# Altium project Hammerhead.PrjPCB (part 2 of 2)
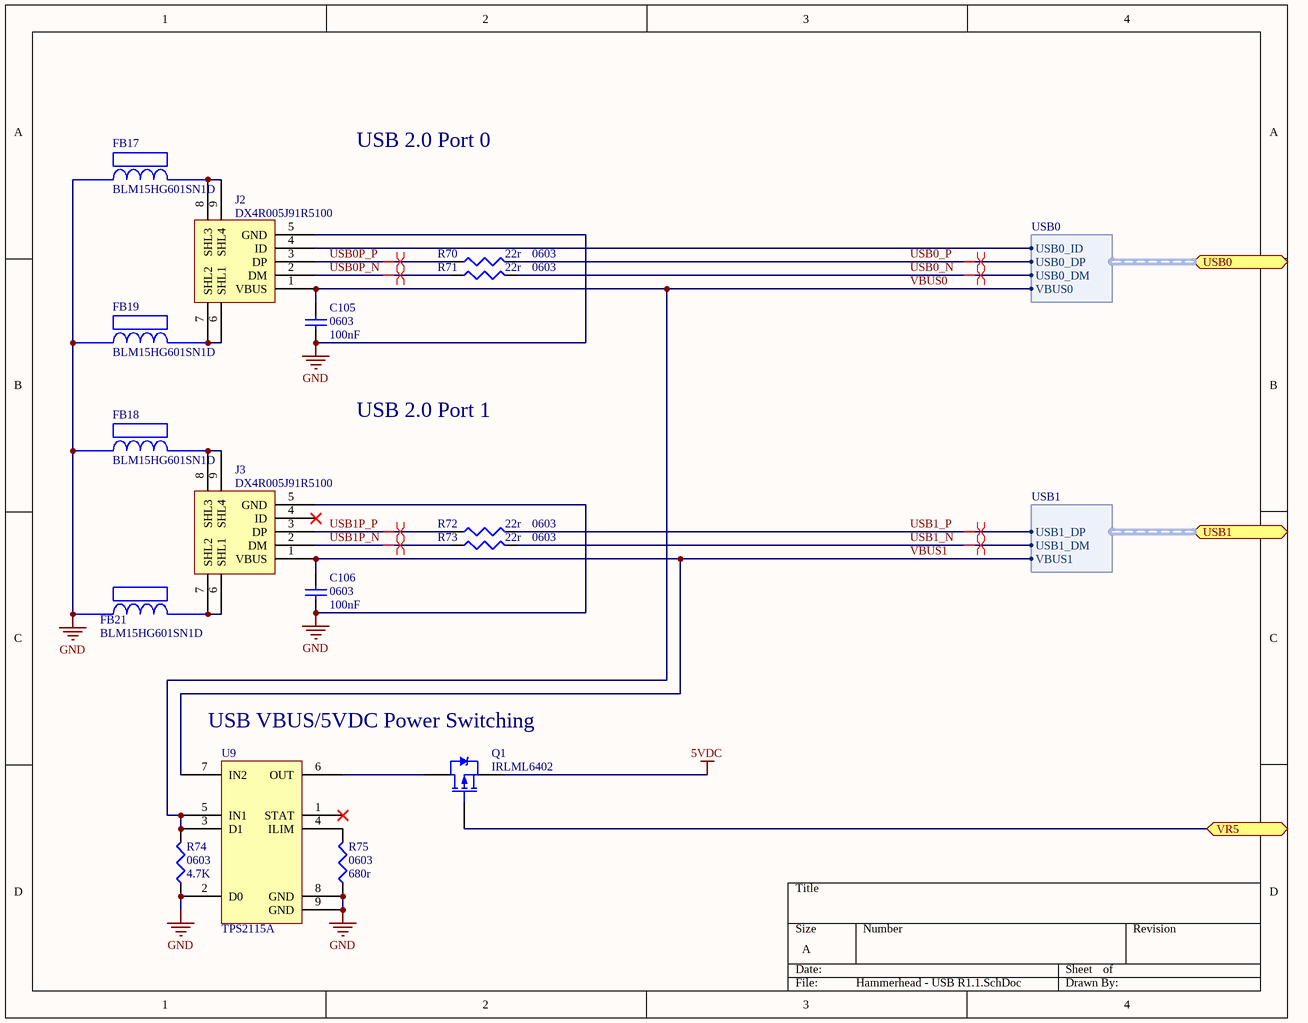
[diagram p8: Hammerhead - USB R1.1.SchDoc]

## Nets that join several sheets
5VDC: Hammerhead - Arduino Leonardo Shield Headers R1.1 (P1.9), Hammerhead - LPC4337 MCU R1.1 (C7.2 C8.2 P7.4 U2.14), Hammerhead - MAX11300 Breakout Connectors R1.1 (P9.1 P10.1), Hammerhead - Power R1.1 (6 pins), Hammerhead - USB R1.1 (Q1.3)
-AVDD: Hammerhead - MAX11300 Analog Hub R1.1 (5 pins), Hammerhead - Power R1.1 (C54.2 C56.2 FB16.2)
AVDD: Hammerhead - MAX11300 Analog Hub R1.1 (6 pins), Hammerhead - Power R1.1 (7 pins)
DVDD: Hammerhead - Arduino Leonardo Shield Headers R1.1 (P1.3 P1.7 P2.2), Hammerhead - LPC4337 MCU R1.1 (42 pins), Hammerhead - MAX11300 Analog Hub R1.1 (R20.1), Hammerhead - Power R1.1 (C101.1 C102#2.2 R21.2 U8.1)
GND: Hammerhead - Arduino Leonardo Shield Headers R1.1 (P1.11 P1.13 P2.6 P3.8), Hammerhead - LPC4337 MCU R1.1 (45 pins), Hammerhead - MAX11300 Analog Hub R1.1 (24 pins), Hammerhead - MAX11300 Breakout Connectors R1.1 (6 pins), Hammerhead - Power R1.1 (42 pins), Hammerhead - USB R1.1 (13 pins)
VIN: Hammerhead - Arduino Leonardo Shield Headers R1.1 (P1.15), Hammerhead - MAX11300 Breakout Connectors R1.1 (P9.3 P10.3), Hammerhead - Power R1.1 (10 pins)
ADC0_5: Hammerhead - Arduino Leonardo Shield Headers R1.1 (P5.2), Hammerhead - LPC4337 MCU R1.1 (U1.144)
ADC0_7: Hammerhead - Arduino Leonardo Shield Headers R1.1 (P5.4), Hammerhead - LPC4337 MCU R1.1 (U1.136)
AN0: Hammerhead - Arduino Leonardo Shield Headers R1.1 (P5.1), Hammerhead - LPC4337 MCU R1.1 (U1.138)
AN1: Hammerhead - Arduino Leonardo Shield Headers R1.1 (P5.3), Hammerhead - LPC4337 MCU R1.1 (U1.139)
AN2: Hammerhead - Arduino Leonardo Shield Headers R1.1 (P5.5), Hammerhead - LPC4337 MCU R1.1 (U1.2)
AN3: Hammerhead - Arduino Leonardo Shield Headers R1.1 (P5.7), Hammerhead - LPC4337 MCU R1.1 (U1.142)
AN4: Hammerhead - Arduino Leonardo Shield Headers R1.1 (P5.9), Hammerhead - LPC4337 MCU R1.1 (U1.6)
CNVT: Hammerhead - LPC4337 MCU R1.1 (U1.46), Hammerhead - MAX11300 Analog Hub R1.1 (R26.1)
Digi_2: Hammerhead - Arduino Leonardo Shield Headers R1.1 (P4.12), Hammerhead - LPC4337 MCU R1.1 (U1.91)
GPIO1_0: Hammerhead - Arduino Leonardo Shield Headers R1.1 (P3.3), Hammerhead - LPC4337 MCU R1.1 (U1.50)
GPIO1_1: Hammerhead - Arduino Leonardo Shield Headers R1.1 (P3.5), Hammerhead - LPC4337 MCU R1.1 (U1.51)
GPIO1_3: Hammerhead - Arduino Leonardo Shield Headers R1.1 (P3.7), Hammerhead - LPC4337 MCU R1.1 (U1.53)
GPIO1_5: Hammerhead - Arduino Leonardo Shield Headers R1.1 (P3.9), Hammerhead - LPC4337 MCU R1.1 (U1.56)
GPIO1_9: Hammerhead - Arduino Leonardo Shield Headers R1.1 (P3.1), Hammerhead - LPC4337 MCU R1.1 (U1.49)
GPIO1_10: Hammerhead - Arduino Leonardo Shield Headers R1.1 (P5.12), Hammerhead - LPC4337 MCU R1.1 (U1.102)
GPIO1_12: Hammerhead - Arduino Leonardo Shield Headers R1.1 (P3.17), Hammerhead - LPC4337 MCU R1.1 (U1.34)
GPIO2_0: Hammerhead - Arduino Leonardo Shield Headers R1.1 (P4.10), Hammerhead - LPC4337 MCU R1.1 (U1.1)
GPIO2_2: Hammerhead - Arduino Leonardo Shield Headers R1.1 (P4.3), Hammerhead - LPC4337 MCU R1.1 (U1.8)
GPIO2_5: Hammerhead - Arduino Leonardo Shield Headers R1.1 (P4.1), Hammerhead - LPC4337 MCU R1.1 (U1.10)
GPIO2_6: Hammerhead - Arduino Leonardo Shield Headers R1.1 (P3.16), Hammerhead - LPC4337 MCU R1.1 (U1.97)
GPIO2_7: Hammerhead - Arduino Leonardo Shield Headers R1.1 (P4.4), Hammerhead - LPC4337 MCU R1.1 (U1.65)
GPIO2_9: Hammerhead - Arduino Leonardo Shield Headers R1.1 (P3.18), Hammerhead - LPC4337 MCU R1.1 (U1.37)
GPIO2_12: Hammerhead - Arduino Leonardo Shield Headers R1.1 (P3.11), Hammerhead - LPC4337 MCU R1.1 (U1.54)
GPIO2_14: Hammerhead - Arduino Leonardo Shield Headers R1.1 (P4.6), Hammerhead - LPC4337 MCU R1.1 (U1.7)
GPIO3_0: Hammerhead - Arduino Leonardo Shield Headers R1.1 (P1.2), Hammerhead - LPC4337 MCU R1.1 (U1.74)
GPIO3_1: Hammerhead - Arduino Leonardo Shield Headers R1.1 (P1.6), Hammerhead - LPC4337 MCU R1.1 (U1.78)
GPIO3_2: Hammerhead - Arduino Leonardo Shield Headers R1.1 (P1.8), Hammerhead - LPC4337 MCU R1.1 (U1.79)
GPIO3_3: Hammerhead - Arduino Leonardo Shield Headers R1.1 (P4.14), Hammerhead - LPC4337 MCU R1.1 (U1.80)
GPIO3_4: Hammerhead - Arduino Leonardo Shield Headers R1.1 (P4.16), Hammerhead - LPC4337 MCU R1.1 (U1.82)
GPIO3_5: Hammerhead - Arduino Leonardo Shield Headers R1.1 (P4.8), Hammerhead - LPC4337 MCU R1.1 (U1.83)
GPIO3_6: Hammerhead - Arduino Leonardo Shield Headers R1.1 (P5.10), Hammerhead - LPC4337 MCU R1.1 (U1.100)
GPIO3_8: Hammerhead - Arduino Leonardo Shield Headers R1.1 (P4.5), Hammerhead - LPC4337 MCU R1.1 (U1.110)
GPIO3_9: Hammerhead - Arduino Leonardo Shield Headers R1.1 (P4.7), Hammerhead - LPC4337 MCU R1.1 (U1.113)
GPIO3_10: Hammerhead - Arduino Leonardo Shield Headers R1.1 (P4.11), Hammerhead - LPC4337 MCU R1.1 (U1.115)
GPIO3_11: Hammerhead - Arduino Leonardo Shield Headers R1.1 (P4.15), Hammerhead - LPC4337 MCU R1.1 (U1.117)
GPIO4_11: Hammerhead - Arduino Leonardo Shield Headers R1.1 (P3.15), Hammerhead - LPC4337 MCU R1.1 (U1.72)
GPIO5_7: Hammerhead - Arduino Leonardo Shield Headers R1.1 (P5.8), Hammerhead - LPC4337 MCU R1.1 (U1.98)
GPIO5_8: Hammerhead - Arduino Leonardo Shield Headers R1.1 (P4.9), Hammerhead - LPC4337 MCU R1.1 (U1.114)
GPIO5_9: Hammerhead - Arduino Leonardo Shield Headers R1.1 (P4.13), Hammerhead - LPC4337 MCU R1.1 (U1.116)
GPIO5_12: Hammerhead - Arduino Leonardo Shield Headers R1.1 (P3.14), Hammerhead - LPC4337 MCU R1.1 (U1.15)
GPIO5_13: Hammerhead - Arduino Leonardo Shield Headers R1.1 (P3.12), Hammerhead - LPC4337 MCU R1.1 (U1.33)
GPIO5_14: Hammerhead - Arduino Leonardo Shield Headers R1.1 (P3.10), Hammerhead - LPC4337 MCU R1.1 (U1.35)
GPIO5_15: Hammerhead - Arduino Leonardo Shield Headers R1.1 (P1.14), Hammerhead - LPC4337 MCU R1.1 (U1.85)
GPIO5_16: Hammerhead - Arduino Leonardo Shield Headers R1.1 (P1.16), Hammerhead - LPC4337 MCU R1.1 (U1.86)
GPIO5_18: Hammerhead - Arduino Leonardo Shield Headers R1.1 (P3.13), Hammerhead - LPC4337 MCU R1.1 (U1.69)
I2C1_SCL: Hammerhead - Arduino Leonardo Shield Headers R1.1 (P3.2), Hammerhead - LPC4337 MCU R1.1 (U1.88)
I2C1_SDA: Hammerhead - Arduino Leonardo Shield Headers R1.1 (P3.4), Hammerhead - LPC4337 MCU R1.1 (U1.87)
INT: Hammerhead - LPC4337 MCU R1.1 (U1.39), Hammerhead - MAX11300 Analog Hub R1.1 (R25.1)
MAX_CS: Hammerhead - LPC4337 MCU R1.1 (U1.38), Hammerhead - MAX11300 Analog Hub R1.1 (R24.1)
MISO: Hammerhead - LPC4337 MCU R1.1 (U1.42), Hammerhead - MAX11300 Analog Hub R1.1 (R27.1)
MOSI: Hammerhead - LPC4337 MCU R1.1 (U1.43), Hammerhead - MAX11300 Analog Hub R1.1 (R30.1)
NetD3_1: Hammerhead - Power R1.1 (D3.1 P8.1), Hammerhead - USB R1.1 (Q1.1)
NetP5_11: Hammerhead - Arduino Leonardo Shield Headers R1.1 (P5.11), Hammerhead - LPC4337 MCU R1.1 (P6.2)
NetR28_1: Hammerhead - MAX11300 Analog Hub R1.1 (U3.28), Hammerhead - MAX11300 Breakout Connectors R1.1 (R28.1)
NetR29_2: Hammerhead - MAX11300 Analog Hub R1.1 (U3.29), Hammerhead - MAX11300 Breakout Connectors R1.1 (R29.2)
NetR32_1: Hammerhead - MAX11300 Analog Hub R1.1 (U3.27), Hammerhead - MAX11300 Breakout Connectors R1.1 (R32.1)
NetR33_2: Hammerhead - MAX11300 Analog Hub R1.1 (U3.30), Hammerhead - MAX11300 Breakout Connectors R1.1 (R33.2)
NetR36_1: Hammerhead - MAX11300 Analog Hub R1.1 (U3.26), Hammerhead - MAX11300 Breakout Connectors R1.1 (R36.1)
NetR37_2: Hammerhead - MAX11300 Analog Hub R1.1 (U3.31), Hammerhead - MAX11300 Breakout Connectors R1.1 (R37.2)
NetR40_1: Hammerhead - MAX11300 Analog Hub R1.1 (U3.25), Hammerhead - MAX11300 Breakout Connectors R1.1 (R40.1)
NetR41_2: Hammerhead - MAX11300 Analog Hub R1.1 (U3.34), Hammerhead - MAX11300 Breakout Connectors R1.1 (R41.2)
NetR44_1: Hammerhead - MAX11300 Analog Hub R1.1 (U3.24), Hammerhead - MAX11300 Breakout Connectors R1.1 (R44.1)
NetR45_2: Hammerhead - MAX11300 Analog Hub R1.1 (U3.35), Hammerhead - MAX11300 Breakout Connectors R1.1 (R45.2)
NetR48_1: Hammerhead - MAX11300 Analog Hub R1.1 (U3.23), Hammerhead - MAX11300 Breakout Connectors R1.1 (R48.1)
NetR49_2: Hammerhead - MAX11300 Analog Hub R1.1 (U3.36), Hammerhead - MAX11300 Breakout Connectors R1.1 (R49.2)
NetR52_1: Hammerhead - MAX11300 Analog Hub R1.1 (U3.21), Hammerhead - MAX11300 Breakout Connectors R1.1 (R52.1)
NetR53_2: Hammerhead - MAX11300 Analog Hub R1.1 (U3.37), Hammerhead - MAX11300 Breakout Connectors R1.1 (R53.2)
NetR56_1: Hammerhead - MAX11300 Analog Hub R1.1 (U3.18), Hammerhead - MAX11300 Breakout Connectors R1.1 (R56.1)
NetR57_2: Hammerhead - MAX11300 Analog Hub R1.1 (U3.38), Hammerhead - MAX11300 Breakout Connectors R1.1 (R57.2)
NetR60_1: Hammerhead - MAX11300 Analog Hub R1.1 (U3.17), Hammerhead - MAX11300 Breakout Connectors R1.1 (R60.1)
NetR61_2: Hammerhead - MAX11300 Analog Hub R1.1 (U3.39), Hammerhead - MAX11300 Breakout Connectors R1.1 (R61.2)
NetR64_1: Hammerhead - MAX11300 Analog Hub R1.1 (U3.16), Hammerhead - MAX11300 Breakout Connectors R1.1 (R64.1)
NetR65_2: Hammerhead - MAX11300 Analog Hub R1.1 (U3.40), Hammerhead - MAX11300 Breakout Connectors R1.1 (R65.2)
RESET: Hammerhead - Arduino Leonardo Shield Headers R1.1 (P1.5), Hammerhead - LPC4337 MCU R1.1 (5 pins)
SCLK: Hammerhead - LPC4337 MCU R1.1 (U1.112), Hammerhead - MAX11300 Analog Hub R1.1 (R23.1)
SGPIO6: Hammerhead - Arduino Leonardo Shield Headers R1.1 (P1.12), Hammerhead - LPC4337 MCU R1.1 (U1.84)
SSP1_MISO: Hammerhead - Arduino Leonardo Shield Headers R1.1 (P2.1), Hammerhead - LPC4337 MCU R1.1 (U1.44)
SSP1_MOSI: Hammerhead - Arduino Leonardo Shield Headers R1.1 (P2.4), Hammerhead - LPC4337 MCU R1.1 (U1.47)
SSP1_SCK: Hammerhead - Arduino Leonardo Shield Headers R1.1 (P2.3), Hammerhead - LPC4337 MCU R1.1 (U1.45)
SSP1_SSEL: Hammerhead - Arduino Leonardo Shield Headers R1.1 (P2.5), Hammerhead - LPC4337 MCU R1.1 (U1.48)
U0_RXD: Hammerhead - Arduino Leonardo Shield Headers R1.1 (P1.10), Hammerhead - LPC4337 MCU R1.1 (U1.81)
U0_TXD: Hammerhead - Arduino Leonardo Shield Headers R1.1 (P1.4), Hammerhead - LPC4337 MCU R1.1 (U1.75)
USB0_ID: Hammerhead - LPC4337 MCU R1.1 (U1.22), Hammerhead - USB R1.1 (J2.4)
USB0_N: Hammerhead - LPC4337 MCU R1.1 (U1.20), Hammerhead - USB R1.1 (R71.2)
USB0_P: Hammerhead - LPC4337 MCU R1.1 (U1.18), Hammerhead - USB R1.1 (R70.2)
USB1_N: Hammerhead - LPC4337 MCU R1.1 (U1.90), Hammerhead - USB R1.1 (R73.2)
USB1_P: Hammerhead - LPC4337 MCU R1.1 (U1.89), Hammerhead - USB R1.1 (R72.2)
VBUS0: Hammerhead - LPC4337 MCU R1.1 (U1.21), Hammerhead - USB R1.1 (5 pins)
VDDA: Hammerhead - Arduino Leonardo Shield Headers R1.1 (P3.6), Hammerhead - LPC4337 MCU R1.1 (C17.2 C18.2 FB5.2 U1.137)